# EAGLE design LED_base_right (EAGLE 9.6.2)
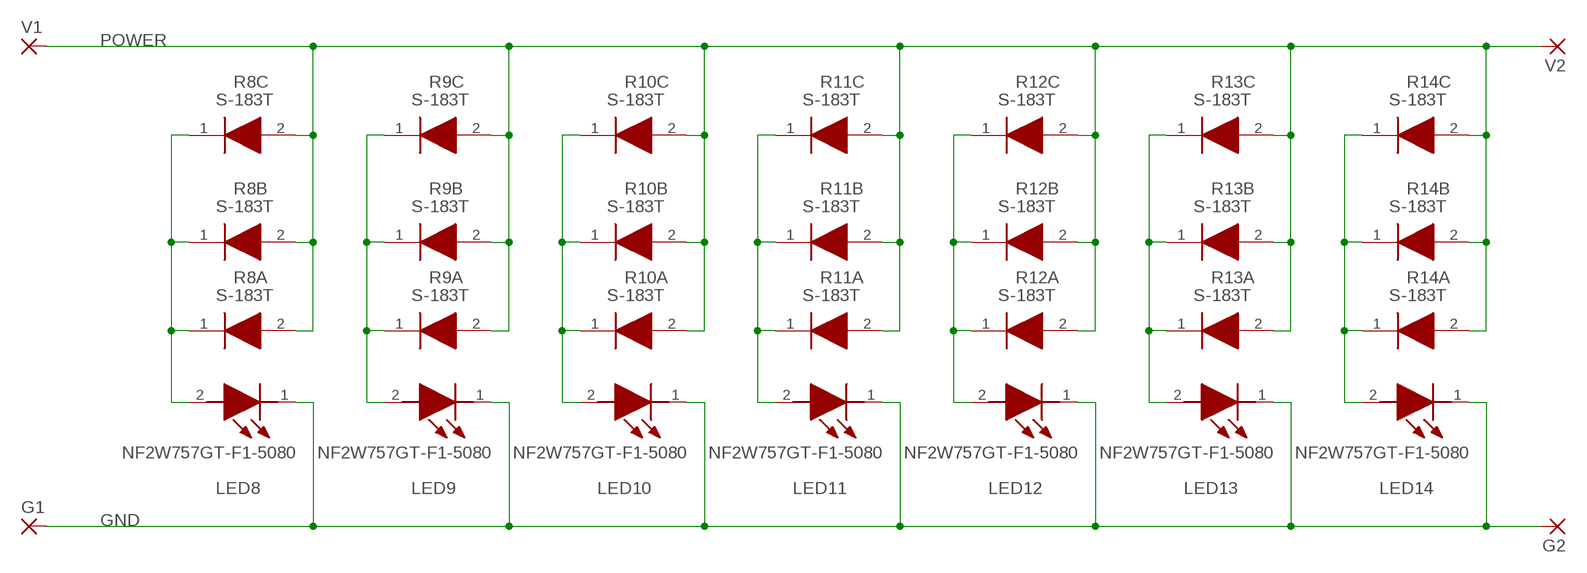
[diagram p0: schematic, sheet 1]

## Parts
G1  SMD_HALF  [SMD1.75-2.5]
G2  SMD_FULL  [SMD3.5-2.5]
LED8  NF2W757GT-F1-5080  [NF2W757DRTX]
LED9  NF2W757GT-F1-5080  [NF2W757DRTX]
LED10  NF2W757GT-F1-5080  [NF2W757DRTX]
LED11  NF2W757GT-F1-5080  [NF2W757DRTX]
LED12  NF2W757GT-F1-5080  [NF2W757DRTX]
LED13  NF2W757GT-F1-5080  [NF2W757DRTX]
LED14  NF2W757GT-F1-5080  [NF2W757DRTX]
R8A  S-183T  [SODFL3516X70NX]
R8B  S-183T  [SODFL3516X70NX]
R8C  S-183T  [SODFL3516X70NX]
R9A  S-183T  [SODFL3516X70NX]
R9B  S-183T  [SODFL3516X70NX]
R9C  S-183T  [SODFL3516X70NX]
R10A  S-183T  [SODFL3516X70NX]
R10B  S-183T  [SODFL3516X70NX]
R10C  S-183T  [SODFL3516X70NX]
R11A  S-183T  [SODFL3516X70NX]
R11B  S-183T  [SODFL3516X70NX]
R11C  S-183T  [SODFL3516X70NX]
R12A  S-183T  [SODFL3516X70NX]
R12B  S-183T  [SODFL3516X70NX]
R12C  S-183T  [SODFL3516X70NX]
R13A  S-183T  [SODFL3516X70NX]
R13B  S-183T  [SODFL3516X70NX]
R13C  S-183T  [SODFL3516X70NX]
R14A  S-183T  [SODFL3516X70NX]
R14B  S-183T  [SODFL3516X70NX]
R14C  S-183T  [SODFL3516X70NX]
V1  SMD_HALF  [SMD1.75-2.5]
V2  SMD_FULL  [SMD3.5-2.5]

## Nets
GND [PWRGND]: G1.1(P) G2.1(P) LED8.1(K) LED9.1(K) LED10.1(K) LED11.1(K) LED12.1(K) LED13.1(K) LED14.1(K)
N$1: LED8.2(A) R8A.1(K) R8B.1(K) R8C.1(K)
N$2: LED9.2(A) R9A.1(K) R9B.1(K) R9C.1(K)
N$3: LED10.2(A) R10A.1(K) R10B.1(K) R10C.1(K)
N$4: LED11.2(A) R11A.1(K) R11B.1(K) R11C.1(K)
N$5: LED12.2(A) R12A.1(K) R12B.1(K) R12C.1(K)
N$6: LED13.2(A) R13A.1(K) R13B.1(K) R13C.1(K)
N$7: LED14.2(A) R14A.1(K) R14B.1(K) R14C.1(K)
POWER [PWRGND]: R8A.2(A) R8B.2(A) R8C.2(A) R9A.2(A) R9B.2(A) R9C.2(A) R10A.2(A) R10B.2(A) R10C.2(A) R11A.2(A) R11B.2(A) R11C.2(A) R12A.2(A) R12B.2(A) R12C.2(A) R13A.2(A) R13B.2(A) R13C.2(A) R14A.2(A) R14B.2(A) R14C.2(A) V1.1(P) V2.1(P)

## Library data of the parts
G1 V1 = LED_base:SMD_HALF: SMD PAD
G2 V2 = LED_base:SMD_FULL: SMD PAD
LED8-LED14 = LED_base:NF2W757GT-F1-5080: Nichia NF2W757GT-F1-5080, 5000K Bi-colour White LED, 5080 Diffused SMD package Source: Datasheet <http://uk.rs-online.com/web/p/products/1372170>; DESCRIPTION: Nichia NF2W757GT-F1-5080, 5000K Bi-colour White LED, 5080 Diffused SMD package; HEIGHT: mm; MANUFACTURER_NAME: NICHIA; MANUFACTURER_PART_NUMBER: NF2W757GT-F1-5080; RS_PART_NUMBER: 1372170; RS_PRICE-STOCK: http://uk.rs-online.com/web/p/products/1372170
R8A R8B R8C R9A R9B R9C R10A R10B R10C R11A R11B R11C R12A R12B R12C R13A R13B R13C R14A R14B R14C = LED_base:S-183T: SEMITEC S-183T Constant Current Diode, 20mA, 4.6V max, 2-Pin SMD Source: Datasheet <https://componentsearchengine.com/Datasheets/1/S-183T.pdf>; DESCRIPTION: SEMITEC S-183T Constant Current Diode, 20mA, 4.6V max, 2-Pin SMD; HEIGHT: 0.7mm; MANUFACTURER_NAME: Semitec; MANUFACTURER_PART_NUMBER: S-183T; MOUSER_PART_NUMBER: 954-S-183T; MOUSER_PRICE-STOCK: https://www.mouser.com/Search/Refine.aspx?Keyword=954-S-183T

## Net classes
0 default: width 0.203 mm, clearance 0.203 mm
1 PWRGND: width 0.406 mm, clearance 0.203 mm to class 0, clearance 0.203 mm

## Board
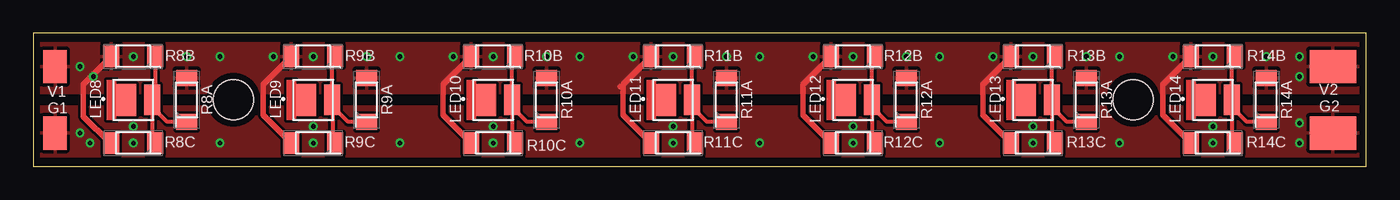
[diagram p1: board, top side]
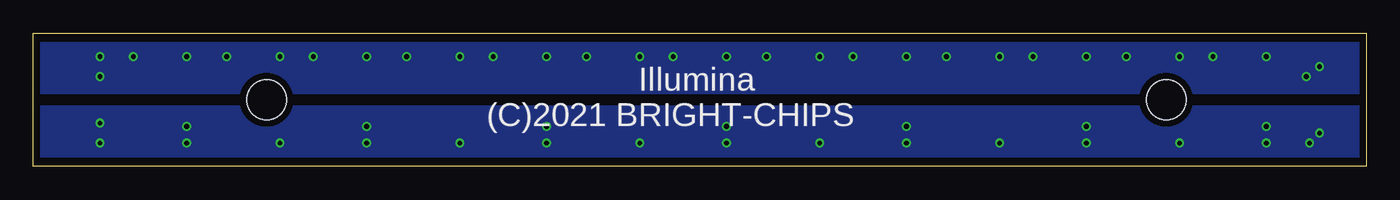
[diagram p2: board, bottom side, seen from below]

Size 100 x 10 mm. Coordinates in mm from the lower left corner, seen from the top.
Outline: 0,0 100,0 100,10 0,10 0,0
Copper layers (1*16): Top 0.035mm / dielectric 1.6mm / Bottom 0.035mm
Design rules "Elecrow_2-layer_PCB_eagle_rule": minimum track width 6mil, minimum drill 12mil, track to track 6mil, track to pad 6mil, pad to pad 6mil, via to via 8mil, smd to smd 0mil, copper to edge 20mil, drill to drill 10mil, minimum pad ring 6mil, minimum via ring 6mil, stop-mask expansion 0mil, vias tented up to drill 100mil, thermal gap 10mil
Holes 3 mm at 15,5 82.5,5

### Footprints (pad centres in the part's own frame; a part is rotated, then mirrored left to right if it is on the bottom)
SMD1.75-2.5 = smd 1.75 x 2.5: 1 0.875,1.25
SMD3.5-2.5 = smd 3.5 x 2.5: 1 1.75,1.25
NF2W757DRTX = smd 1.5 x 2.4: 1 -0.55,0 | smd 1.18 x 2.3: 2 1.41,0
SODFL3516X70NX = smd 1.2 x 1.6: 1 -1.65,0; 2 1.65,0

### Placement (x,y rotation side)
G1  0.75,1.25 0 top
G2  95.75,1.25 0 top
LED8  7.5,5 0 top
LED9  21,5 0 top
LED10  34.5,5 0 top
LED11  48,5 0 top
LED12  61.5,5 0 top
LED13  75,5 0 top
LED14  88.5,5 0 top
R8A  11.5,5 90 top
R8B  7.5,8.25 180 top
R8C  7.5,1.75 180 top
R9A  25,5 90 top
R9B  21,8.25 180 top
R9C  21,1.75 180 top
R10A  38.5,5 90 top
R10B  34.5,8.25 180 top
R10C  34.5,1.75 180 top
R11A  52,5 90 top
R11B  48,8.25 180 top
R11C  48,1.75 180 top
R12A  65.5,5 90 top
R12B  61.5,8.25 180 top
R12C  61.5,1.75 180 top
R13A  79,5 90 top
R13B  75,8.25 180 top
R13C  75,1.75 180 top
R14A  92.5,5 90 top
R14B  88.5,8.25 180 top
R14C  88.5,1.75 180 top
V1  0.75,6.25 0 top
V2  95.75,6.25 0 top

### Tracks (layer width: path | path; a pad name or v marks a point on that pad's centre or on a via)
GND  (via drill 0.35)
  other vias: 95,3.25 95,1.75 88.5,1.75 75,1.75 61.5,1.75 48,1.75 34.5,1.75 21,1.75 7.5,1.75 4.25,1.75 14,1.75 27.5,1.75 41,1.75 54.5,1.75 68,1.75 81.5,1.75 88.5,3 75,3 61.5,3 48,3 34.5,3 21,3 7.5,3 3.5,2.5
  pour Bottom: 0.5,4.5 0.5,0.75 99.5,0.75 99.5,4.5
  pour Top: 0.5,4.5 0.5,0.75 99.5,0.75 99.5,4.5
N$1
  Top 0.305: R8B.1 9.15,5.24 LED8.2 8.91,4.5 | 8.91,4.5 8.91,1.99 R8C.1 | R8A.1 10.06,3.35 8.91,4.5
N$2
  Top 0.305: R9B.1 22.39,7.99 22.39,5.02 LED9.2 22.72,4.69 22.72,4.25 | R9C.1 22.47,1.93 22.47,4.5 22.72,4.25 | R9A.1 23.62,3.35 22.72,4.25
N$3
  Top 0.305: R10B.1 35.91,8.01 LED10.2 35.91,4.5 | 35.91,4.5 35.91,1.99 R10C.1 | R10A.1 37.06,3.35 35.91,4.5
N$4
  Top 0.305: R11B.1 49.41,8.01 LED11.2 49.41,4.5 | 49.41,4.5 49.41,1.99 R11C.1 | R11A.1 50.56,3.35 49.41,4.5
N$5
  Top 0.305: R12B.1 62.91,8.01 LED12.2 62.91,4.5 | 62.91,4.5 62.91,1.99 R12C.1 | R12A.1 64.06,3.35 62.91,4.5
N$6
  Top 0.305: R13B.1 76.41,8.01 LED13.2 76.41,4.5 | 76.41,4.5 76.41,1.99 R13C.1 | R13A.1 77.56,3.35 76.41,4.5
N$7
  Top 0.305: R14B.1 89.91,8.01 LED14.2 89.91,4.5 | 89.91,4.5 89.91,1.99 R14C.1 | R14A.1 91.06,3.35 89.91,4.5
POWER  (via drill 0.35)
  Top 0.406: R8B.2 3.75,6.15 3.75,3.75 5.75,1.75 R8C.2 | 44.1,6 44,6 | R12B.2 57.75,6.15 57.75,3.85 R12C.2 | R13B.2 71.25,6.15 71.25,3.85 R13C.2 | R14B.2 84.75,6.15 84.75,3.85 R14C.2 | R11B.2 44.25,6.15 44.25,3.85 R11C.2 | R10B.2 30.75,6.15 30.75,3.85 R10C.2 | R9B.2 17.25,6.15 17.25,3.85 R9C.2
  other vias: 18,8.25 31.5,8.25 45,8.25 58.5,8.25 72,8.25 85.5,8.25 95,6.75 95,8.25 81.5,8.25 68,8.25 54.5,8.25 41,8.25 27.5,8.25 14,8.25 3.5,7.5 4.5,6.75 7.5,8.25 21,8.25 34.5,8.25 48,8.25 61.5,8.25 75,8.25 88.5,8.25 92.5,8.25 79,8.25 65.5,8.25 52,8.25 38.5,8.25 25,8.25 11.5,8.25
  pour Bottom: 0.5,9.25 0.5,5.5 99.5,5.5 99.5,9.25
  pour Top: 0.5,9.25 0.5,5.5 99.5,5.5 99.5,9.25

### Text on the board
bPlace: Illumina / (C)2021 BRIGHT-CHIPS